# EAGLE design Narrow AAA sensor v1 (EAGLE 7.3.0)
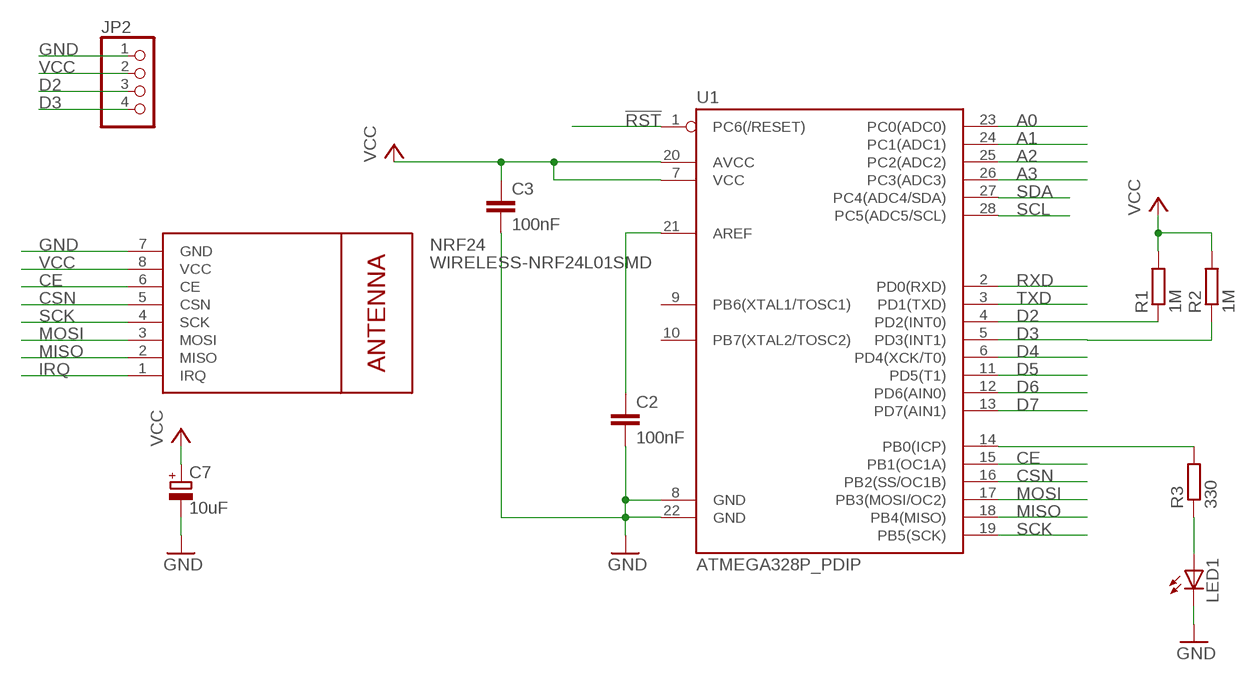
[diagram p0: schematic, sheet 1]

## Parts
C2  100nF  C-EU025-025X050  [C025-025X050]
C3  100nF  C-EU025-025X050  [C025-025X050]
C7  10uF  CPOL-EUE2.5-5  [E2,5-5]
JP2  PINHD-1X4  [1X04]
LED1  LED3MM  [LED3MM]
NRF24  WIRELESS-NRF24L01SMD  [WIRELESS-NRF24L01-SMD]
R1  1M  R-EU_0204/7  [0204/7]
R2  1M  R-EU_0204/7  [0204/7]
R3  330  R-EU_0204/7  [0204/7]
U1  ATMEGA328P_PDIP  [DIL28-3]

## Nets
!RST: U1.1(PC6(/RESET))
A0: U1.23(PC0(ADC0))
A1: U1.24(PC1(ADC1))
A2: U1.25(PC2(ADC2))
A3: U1.26(PC3(ADC3))
CE: NRF24.6(CE) U1.15(PB1(OC1A))
CSN: NRF24.5(CSN) U1.16(PB2(SS/OC1B))
D2: JP2.3 R1.1 U1.4(PD2(INT0))
D3: JP2.4 R2.1 U1.5(PD3(INT1))
D4: U1.6(PD4(XCK/T0))
D5: U1.11(PD5(T1))
D6: U1.12(PD6(AIN0))
D7: U1.13(PD7(AIN1))
GND [power]: C2.2 C3.2 C7.- JP2.1 LED1.K(C) NRF24.7(GND) U1.8(GND) U1.22(GND)
IRQ: NRF24.1(IRQ)
MISO: NRF24.2(MISO) U1.18(PB4(MISO))
MOSI: NRF24.3(MOSI) U1.17(PB3(MOSI/OC2))
N$3: LED1.A R3.1
N$5: R3.2 U1.14(PB0(ICP))
N$8: C2.1 U1.21(AREF)
RXD: U1.2(PD0(RXD))
SCK: NRF24.4(SCK) U1.19(PB5(SCK))
SCL: U1.28(PC5(ADC5/SCL))
SDA: U1.27(PC4(ADC4/SDA))
TXD: U1.3(PD1(TXD))
VCC [power]: C3.1 C7.+ JP2.2 NRF24.8(VCC) R1.2 R2.2 U1.7(VCC) U1.20(AVCC)
Unconnected: U1.9(PB6(XTAL1/TOSC1)) U1.10(PB7(XTAL2/TOSC2))

## Library data of the parts
C2 C3 = GertSanders:C-EU: CAPACITOR, European symbol
C7 = rcl:CPOL-EU: POLARIZED CAPACITOR, European symbol
JP2 = GertSanders:PINHD-1X4: PIN HEADER
LED1 = adafruit:LED: LED OSRAM: - CHIPLED LG R971, LG N971, LY N971, LG Q971, LY Q971, LO R971, LY R971 LH N974, LH R974 LS Q976, LO Q976, LY Q976 LO Q996 - Hyper CHIPLED LW Q18S LB Q993, LB Q99A, LB R99A - SideLED LS A670, LO A670, LY A670, LG A670, LP A670 LB A673, LV A673, LT A673, LW A673 LH A674 LY A675 LS A676, LA A676, LO A676, LY A676, LW A676 LS A679, LY A679, LG A679 - Hyper Micro SIDELED® LS Y876, LA Y876, LO Y876, LY Y876 LT Y87S - SmartLED LW L88C, LW L88S LB L89C, LB L89S, LG L890 LS L89K, LO L89K, LY L89K LS L896, LA L896, LO L896, LY L896 - TOPLED LS T670, LO T670, LY T670, LG T670, LP T670 LSG T670, LSP T670, LSY T670, LOP T670, LYG T670 LG T671, LOG T671, LSG T671 LB T673, LV T673, LT T673, LW T673 LH T674 LS T676, LA T676, LO T676, LY T676, LB T676, LH T676, LSB T676, LW T676 LB T67C, LV T67C, LT T67C, LS T67K, LO T67K, LY T67K, LW E67C LS E67B, LA E67B, LO E67B, LY E67B, LB E67C, LV E67C, LT E67C LW T67C LS T679, LY T679, LG T679 LS T770, LO T770, LY T770, LG T770, LP T770 LB T773, LV T773, LT T773, LW T773 LH T774 LS E675, LA E675, LY E675, LS T675 LS T776, LA T776, LO T776, LY T776, LB T776 LHGB T686 LT T68C, LB T68C - Hyper Mini TOPLED® LB M676 - Mini TOPLED Santana® LG M470 LS M47K, LO M47K, LY M47K Source: http://www.osram.convergy.de/
NRF24 = GertSanders:WIRELESS-NRF24L01: 2.4 GHz Wireless Module based on NRF24L01 chip
R1-R3 = rcl:R-EU_: RESISTOR, European symbol
U1 = GertSanders:ATMEGA328P_PDIP: uC used in the Arduino 32kb flash, 1k EEPROM, 2k SRAM This is the through-hole version of this chip.

## Net classes
1 power: width 0.356 mm, clearance 0.178 mm

## Board
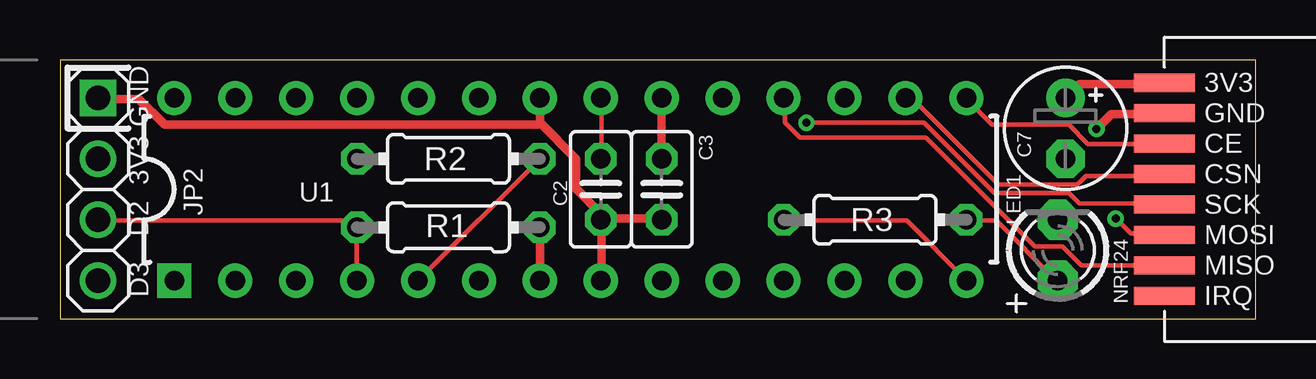
[diagram p1: board, top side]
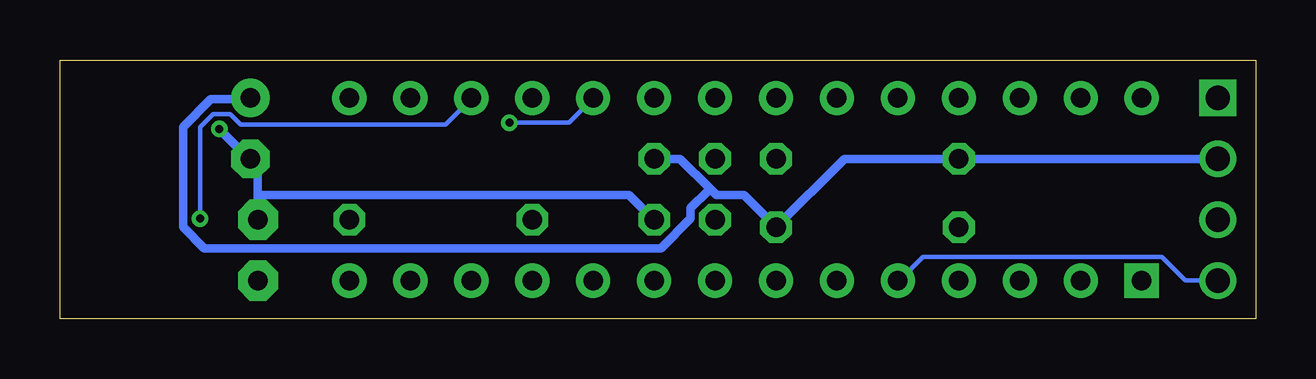
[diagram p2: board, bottom side, seen from below]

Size 49.85 x 10.79 mm. Coordinates in mm from the lower left corner, seen from the top.
Outline: 0,0 49.85,0 49.85,10.79 0,10.79 0,0
Copper layers (1*16): Top 0.035mm / dielectric 1.5011mm / Bottom 0.035mm
Design rules "Gert_Sanders": minimum track width 7mil, minimum drill 13mil, track to track 7mil, track to pad 7mil, pad to pad 7mil, via to via 7mil, smd to smd 7mil, copper to edge 20mil, drill to drill 10mil, minimum pad ring 10mil, minimum via ring 7mil, stop-mask expansion 3mil, vias tented up to drill 14mil, thermal gap 10mil

### Footprints (pad centres in the part's own frame; a part is rotated, then mirrored left to right if it is on the bottom)
C025-025X050 = drill 0.813 octagon: 1 -1.27,0; 2 1.27,0
E2,5-5 = drill 0.813 pad 1.6: + -1.27,0 | drill 0.813 pad 1.6 octagon: - 1.27,0
1X04 = drill 1.016 square: 1 -3.81,0 | drill 1.016: 2 -1.27,0; 3 1.27,0; 4 3.81,0
LED3MM = drill 0.813 pad 1.676 octagon: A -1.27,0; K 1.27,0
WIRELESS-NRF24L01-SMD = smd 2.54 x 0.762: 1 1.27,0; 2 1.27,1.27; 3 1.27,2.54; 4 1.27,3.81; 5 1.27,5.08; 6 1.27,6.35; 7 1.27,7.62; 8 1.27,8.89
0204/7 = drill 0.813 octagon: 1 -3.81,0; 2 3.81,0
DIL28-3 = drill 0.813 pad 1.422 square: 1 -16.51,-3.81 | drill 0.813 pad 1.422: 2 -13.97,-3.81; 3 -11.43,-3.81; 4 -8.89,-3.81; 5 -6.35,-3.81; 6 -3.81,-3.81; 7 -1.27,-3.81; 8 1.27,-3.81; 9 3.81,-3.81; 10 6.35,-3.81; 11 8.89,-3.81; 12 11.43,-3.81; 13 13.97,-3.81; 14 16.51,-3.81; 15 16.51,3.81; 16 13.97,3.81; 17 11.43,3.81; 18 8.89,3.81; 19 6.35,3.81; 20 3.81,3.81; 21 1.27,3.81; 22 -1.27,3.81; 23 -3.81,3.81; 24 -6.35,3.81; 25 -8.89,3.81; 26 -11.43,3.81; 27 -13.97,3.81; 28 -16.51,3.81

### Placement (x,y rotation side)
C2  22.54,5.4 270 top
C3  25.08,5.4 270 top
C7  41.91,7.94 270 top
JP2  1.59,5.4 270 top
LED1  41.59,2.86 90 top
NRF24  44.77,0.95 0 top
R1  16.19,3.81 0 top
R2  16.19,6.67 180 top
R3  33.97,4.13 180 top
U1  21.27,5.4 0 top

### Tracks (layer width: path | path; a pad name or v marks a point on that pad's centre or on a via)
CE
  Top 0.178: NRF24.6 45.96,7.29 42.85,7.29 42.05,8.09 38.85,8.09 37.78,9.16 U1.15
CSN
  Top 0.178: NRF24.5 45.96,5.96 42.76,5.96 42.41,5.6 39.12,5.6 35.56,9.16 35.29,9.16 U1.16
D2
  Top 0.178: U1.4 12.36,1.6 12.36,3.73 R1.1 12.27,3.73 11.91,4.09 1.6,4.09 JP2.3
D3
  Top 0.178: R2.1 14.94,1.6 U1.5
  Bottom 0.178: JP2.4 2.93,1.6 3.91,2.58 13.87,2.58 14.85,1.6 U1.5
GND  (via drill 0.33)
  Top 0.356: v43.2,7.91 43.83,8.53 45.96,8.53 NRF24.7 | C2.2 22.58,4.18 25.07,4.18 C3.2 | U1.8 22.58,1.6 22.58,4 C2.2 | 20,8.18 20,9.16 U1.22 | 20,8.18 21.51,6.67 21.51,5.42 22.58,4.36 C2.2 | JP2.1 1.6,9.16 3.29,9.16 4.36,8.09 19.91,8.09 20,8.18
  Bottom 0.356: v43.2,7.91 41.96,6.67 C7.- 41.78,6.58 41.6,6.4 41.6,5.16 | 41.6,5.16 41.6,4.18 LED1.K | 41.6,5.16 41.52,5.16 26.14,5.16 25.16,4.18 C3.2
MISO
  Top 0.178: NRF24.2 45.96,2.22 42.58,2.22 41.78,3.02 40.63,3.02 36.09,7.56 30.85,7.56 30.23,8.18 30.23,9.16 U1.18
MOSI  (via drill 0.33)
  Top 0.178: v44.01,4.18 44.63,3.56 45.96,3.56 NRF24.3
  Bottom 0.178: v44.01,4.18 44.01,8 43.47,8.53 42.76,8.53 42.32,8.09 33.78,8.09 32.72,9.16 U1.17
N$3
  Top 0.178: R3.1 37.78,4.09 39.03,4.09 41.52,1.6 LED1.A
N$5
  Top 0.178: R3.2 30.23,4.09 35.29,4.09 U1.14
N$8
  Top 0.178: C2.1 22.58,6.67 22.58,9.16 U1.21
SCK  (via drill 0.33)
  Top 0.178: v31.11,8.18 36.01,8.18 38.94,5.25 42.05,5.25 42.49,4.8 45.96,4.8 NRF24.4
  Bottom 0.178: v31.11,8.18 28.63,8.18 27.65,9.16 U1.19
VCC
  Top 0.356: NRF24.8 45.96,9.78 42.49,9.78 41.96,9.25 C7.+ | C3.1 25.07,9.16 U1.20 | R1.2 20,3.73 U1.7
  Bottom 0.356: JP2.2 12.27,6.67 R2.2 12.45,6.67 17.16,6.67 20,3.82 R1.2 20.09,3.91 21.34,5.16 22.49,5.16 22.76,5.42 | 22.76,5.42 24,6.67 C3.1 | C7.+ 41.96,9.16 43.56,9.16 44.72,8 44.72,3.82 43.83,2.93 24.8,2.93 23.56,4.18 23.56,4.62 22.85,5.33 22.76,5.42

### Text on the board
tPlace: GND | 3V3 | D2 | D3